# Altium schematic sheet LM2596.SchDoc
size A4
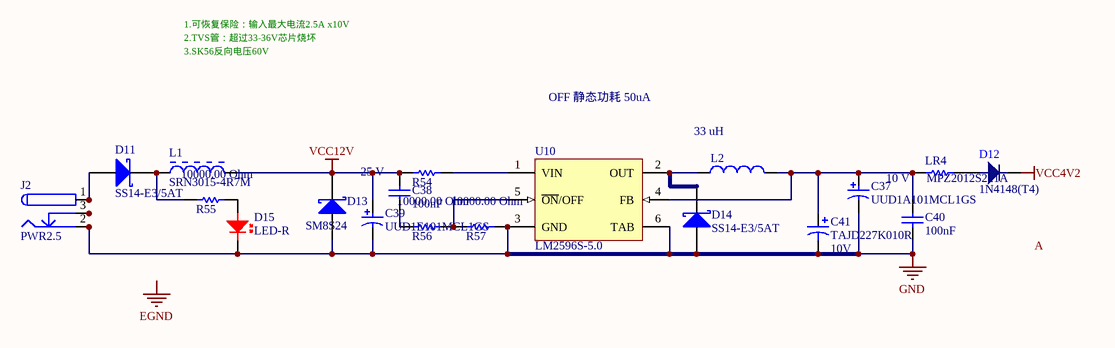
[diagram p0: LM2596.SchDoc]

## Parts
C37  UUD1A101MCL1GS  Rated Voltage: 10 V  [NIC-CAPA2-6.3X5.8_V]
C38  value 100nF  [CAPC0805(2012)100_L]  (hidden comment: CAP 100nF 50V 0805(2012))
C39  UUD1E101MCL1GS  Rated Voltage: 25 V  [NIC-CAPA2-6.3X7.7_V]
C40  value 100nF  [CAPC0805(2012)100_L]  (hidden comment: CAP 100nF 50V 0805(2012))
C41  TAJD227K010R  Rated Voltage: 10V  [AVX-CAPC7343_V]
D11  SS14-E3/5AT  [VISH-DO-214AC-2_V]
D12  1N4148(T4)  [SOD-123]
D13  SM8S24  [DIODE_SMC]
D14  SS14-E3/5AT  [VISH-DO-214AC-2_V]
D15  LED-R  [DIO-LIG]
J2  PWR2.5  [KLD-0202]
L1  SRN3015-4R7M  [BOUR-SRN3015-2_V]
L2  Inductance: 33 uH  [INDP5050X28N]  (hidden comment: SLF7045T-330M1R1-H)
LR4  MPZ2012S221A  [2012[0805]]
R54  2R 1% 0805(2012)  [RESC0805(2012)_L]  (value not drawn)
R55  value 10000.00 Ohm  [RESC0805(2012)_M]  (hidden comment: 10K 1% 0805(2012))
R56  value 10000.00 Ohm  [RESC0805(2012)_M]  (hidden comment: 10K 1% 0805(2012))
R57  value 10000.00 Ohm  [RESC0805(2012)_M]  (hidden comment: 10K 1% 0805(2012))
U10  LM2596S-5.0  [TS5B_N]

## Nets
GND: C37.2 C39.2 C40.1 C41.2 D13.1(A) D14.1(A) D15.2 J2.2 J2.2A J2.2B R57.2 U10.3(GND) U10.6(TAB)
VCC4V2: D12.2
VCC12V: C38.2 C39.1 D13.2(K) L1.2 R54.1
NetC37_1: C37.1 C40.2 C41.1 L2.2 LR4.1 U10.4(FB)
NetC38_1: C38.1 R56.1
NetD11_1: D11.1(A) J2.1 J2.1A J2.1B
NetD11_2: D11.2(K) L1.1 R55.1
NetD12_1: D12.1 LR4.2
NetD14_2: D14.2(K) L2.1 U10.2(OUT)
NetD15_1: D15.1 R55.2
NetJ2_3: J2.3 J2.3A J2.3B
NetR54_2: R54.2 U10.1(VIN)
NetR56_2: R56.2 R57.1 U10.5(~{ON}/OFF)

## Notes on the sheet
- 1.可恢复保险：输入最大电流2.5A x10V
- 2.TVS管：超过33-36V芯片烧坏
- 3.SK56反向电压60V
- OFF 静态功耗 50uA
- Labels drawn without touching a wire or pin: A, EGND

## Library data of the parts
C37 = CMP-0687-00054-1: Aluminum Electrolytic Capacitor, UD Series, Low Impedance, 100 uF, 10 V, + / - 20%, -55 to 105 degC, Chip Type, 6.3 x 5.8 mm D x L, Pb-Free, Reel; Manufacturer: Nichicon; Endurance Time: 2000 h; Packing: Dia382mm Reel; Tolerance Rated Capacitance: -20 to 20%; Rated Capacitance: 100 uF; Impedance: 0.44 Ohm; Rated Ripple Current (at 100kHz): 230 mA; ComponentLink1Description: Manufacturer URL; RoHS: TRUE; ComponentLink2Description: Datasheet; PackageReference: CAPAE-D6.3H5.8; Length: 5.8 mm; DatasheetVersion: 08/2012; ComponentLink3URL: http://products.nichicon.co.jp/en/pdf/XJA043/e-ud.pdf; ComponentLink1URL: http://www.nichicon.co.jp/; ComponentLink2URL: http://products.nichicon.co.jp/en/pdf/XJA043/e-ud.pdf; PartNumber: UUD1A101MCL1GS; PackageDescription: 2-Pin Surface Mount Device, Diameter 6.3 mm, Height 5.8 mm, Pitch 5.4 mm; ComponentLink3Description: Package Specification; Mounting Technology: Surface Mount; Diameter: 6.3 mm
C38 C40 = CMP-1036-04418-1: CAP 100nF 50V ±5% 0805 (2012 Metric) Thickness 1mm SMD; Case-EIA: 0805; Case-Metric: 2012; Tolerance: ±5%; Max Thickness: 1 mm; Technology: SMT; Rated Voltage: 50 V
C39 = CMP-0687-00063-1: Aluminum Electrolytic Capacitor, UD Series, Low Impedance, 100 uF, 25 V, + / - 20%, -55 to 105 degC, Chip Type, 6.3 x 7.7 mm D x L, Pb-Free, Reel; Manufacturer: Nichicon; Rated Ripple Current (at 100kHz): 280 mA; Endurance Time: 2000 h; Packing: Dia382mm Reel; Tolerance Rated Capacitance: -20 to 20%; Impedance: 0.34 Ohm; Rated Capacitance: 100 uF; PackageReference: CAPAE-D6.3H7.7; RoHS: TRUE; PackageDescription: 2-Pin Surface Mount Device, Diameter 6.3 mm, Height 7.7 mm, Pitch 5.4 mm; Mounting Technology: Surface Mount; ComponentLink3Description: Package Specification; Diameter: 6.3 mm; DatasheetVersion: 08/2012; PartNumber: UUD1E101MCL1GS; ComponentLink3URL: http://products.nichicon.co.jp/en/pdf/XJA043/e-ud.pdf; Length: 7.7 mm; ComponentLink2Description: Datasheet; ComponentLink2URL: http://products.nichicon.co.jp/en/pdf/XJA043/e-ud.pdf; ComponentLink1Description: Manufacturer URL; ComponentLink1URL: http://www.nichicon.co.jp/
C41 = CMP-0279-00002-1: Capacitor, Tantalum, 220uF 10% 10V MCCT-D (7343-31); Manufacturer: AVX; Polarity: Polarized; ComponentLink2URL: http://www.avx.com/docs/Catalogs/taj.pdf; PackageReference: CAPC7343; ComponentLink2Description: Datasheet; ComponentLink1URL: http://www.avx.com/; Mounting Technology: Surface Mount; PartNumber: TAJD227K010R; Technology: Tantalum; Tolerance: 10%; Capacitance: 220uF; PackageDescription: 2-Pin SMT Capacitor, 7.3 x 4.3 mm Body; ComponentLink1Description: Manufacturer URL; DatasheetVersion: Jul-13
D11 D14 = CMP-0549-00004-1: Schottky Barrier Rectifier, 40 V Maximum DC Blocking Voltage, -65 to 125 degC, 2-Pin SMA Case, RoHS; Manufacturer: Vishay Semiconductor; IFSM: 40 A; IF(AV): 1 A Max.; VRRM: 40 V Max.; VRMS: 28 V Max.; PackageReference: DO-214AC-2; RoHS: TRUE; DatasheetVersion: 12/17/2012; ComponentLink1Description: Manufacturer URL; ComponentLink2URL: http://www.vishay.com/docs/88746/ss12.pdf; PartNumber: SS14-E3/5AT; PackageVersion: Dec-12; Operating Temperature: -65 to 125 degC; ComponentLink3URL: http://www.vishay.com/docs/88746/ss12.pdf; PackageDescription: 2-Pin SMD, Body 4.245 x 2.665 mm, Height 2.29 mm; ComponentLink1URL: http://www.vishay.com/; ComponentLink3Description: Package Specification; ComponentLink2Description: Datasheet; Mounting Technology: Surface Mount; VDC: 40 V Max.
D12 = 1N4148: 高速开关二极管
D13 = 30BQ040: TVS
D15 = LED-RED: 红色LED
J2 = PWR2.5: Low Voltage Power Supply Connector; Published: 17-Dec-2003; DatasheetDocument: 09-May-2002; Publisher: Altium Limited; ComponentLink1Description: Manufacturer Link; ComponentLink1URL: http://domino.kycon.com/internet/Products.html
L1 = CMP-0007-00005-1: Semi-shielded Power Inductor, 4.7 uH, +/- 20%, 1.4 A, -40 to 125 degC, 3 x 3 x 1.5 mm SMD, RoHS and Halogen Free, Tape and Reel; Manufacturer: Bourns; SRF Min: 65 MHz; Inductance: 4.7 uH; Isat: 1.2 A; Resistance to Solder Heat: +260 degC for 10 sec.; Rated current: 1.4 A; Inductance tolerance: +/- 20%; DCR Max: 0.136 Ohm; RoHS: TRUE; ComponentLink2Description: Datasheet; PackageDescription: 2-Pin SMD, Body 3 x 3 mm, Height 1.5 mm; ComponentLink2URL: http://www.bourns.com/data/global/pdfs/SRN3015.pdf; ComponentLink1URL: http://www.bourns.com/; Packing: Tape and Reel; Mounting Technology: Surface Mount; ComponentLink3URL: http://www.bourns.com/data/global/pdfs/SRN3015.pdf; PackageReference: SRN3015; Operating Temperature: -40 to 125 degC; DatasheetVersion: Aug-11; ComponentLink1Description: Manufacturer URL; ComponentLink3Description: Package Specification; PartNumber: SRN3015-4R7M
L2 = Inductor: 固定电感器 SMD Power Inductor; Manufacturer: TDK; Core Material: Ferrite; Maximum DC Current: 1.1 A; Maximum DC Resistance: 96 mOhms; Shielding: Shielded; Tolerance: 20 %; Type: Wound Ferrite Inductor for Power Circuits; Case Height: 4.5 mm; Case Length: 7 mm; Test Frequency: 100 kHz; Supplier 1: Mouser; Supplier Part Number 1: 810-SLF7045T330M1R1H; Manufacturer Part Number: SLF7045T-330M1R1-H; RoHS: RoHS Compliant; Category: Fixed Inductors; Stock 1: 17; Pricing 1: 1=1.84, 10=1.38, 100=1.06, 500=0.780, 1000=0.734, 2000=0.689, 10000=0.666, 25000=0.643 (AUD); Operating Temperature Range: - 40 C to + 105 C; Package / Case: 7045 metric; Packaging: Reel; Product: Power Inductors; Series: SLF; Termination Style: SMD/SMT; Brand: TDK; Case Width: 7 mm; Product Category: Magnetic Shielded SMD Inductors; Standard Pack Qty: 1000; RoHS - Mouser: Y; Minimum Order Quantity: 1; Reeling: True; ComponentLink1URL: http://www.mouser.com/catalog/specsheets/tdk_e531_slf.pdf; ComponentLink1Description: http://www.mouser.com/catalog/specsheets/tdk_e531_slf.pdf
LR4 = Res Semi: 电磁干扰滤波珠子、扼流圈和阵列 Ferrite Chip Beads; Manufacturer: TDK; 阻抗: 220 Ohms; 最大直流电流: 3 A; 最大直流电阻: 0.04 Ohms; 工作温度范围: - 55 C to + 125 C; 封装 / 箱体: 2012; 封装: Reel; 端接类型: SMD/SMT; 容差: 25 %; 产品种类: Ferrite Beads; 标准包装数量: 4000; Supplier 1: Mouser; Supplier Part Number 1: 810-MPZ2012S221A; Manufacturer Part Number: MPZ2012S221A; RoHS: RoHS Compliant; Description 1: 电磁干扰滤波珠子、扼流圈和阵列 Ferrite Chip Beads; Category: 电磁干扰滤波珠子、扼流圈和阵列; Stock 1: 26540; Pricing 1: 1=0.070, 50=0.060, 100=0.053, 500=0.040, 1000=0.035, 4000=0.031, 8000=0.029, 12000=0.025 (USD); 制造商: TDK; RoHS - 贸泽: Y; Minimum Order Quantity: 1; Reeling: True; ComponentLink1URL: http://www.mouser.com/ds/2/400/e9413_mpz-24582.pdf; ComponentLink1Description: http://www.mouser.com/ds/2/400/e9413_mpz-24582.pdf
R54 = CMP-1013-00203-1: 2R 0.125W 1% 0805 (2012 Metric)  SMD; Case-EIA: 0805; Value: 2.00 Ohm; Case-Metric: 2012; Tolerance: 1 %; Power: 0.125 W; Technology: SMT
R55-R57 = CMP-1013-00623-1: 10K 0.125W 1% 0805 (2012 Metric)  SMD; Case-Metric: 2012; Case-EIA: 0805; Tolerance: 1 %; Power: 0.125 W; Technology: SMT
U10 = LM2596S-5.0: SIMPLE SWITCHER?Power Converter 150 KHz 3A Step-Down Voltage Regulator, 5-pin TO-263; Manufacturer: National Semiconductor; PackageTopMarking: NSUZXYTTE#*LM2596S*-5.0 P+; PowerWise: N; High-Reliability: Y; DatasheetVersion: May-2002; PackageVersion: revD, Apr-2005; PackageReference: TS5B; PackageDescription: TO-263, Molded, .400 x .390 x .180in, 5 Lead, .067in Pitch, Surface Mount; PartNumber: LM2596S-5.0; RoHS: N; PinCount: 5; CompType: Switcher; Code_JEDEC: MO-169-AB; ComponentLink1Description: Manufacturer URL; ComponentLink1URL: http://www.national.com/; ComponentLink2Description: LM2596 Datasheet; ComponentLink2URL: http://www.national.com/ds/LM/LM2596.pdf; ComponentLink3Description: LM2596 Web Page; ComponentLink3URL: http://www.national.com/pf/LM/LM2596.html; ComponentLink4Description: TS5B Package Page; ComponentLink4URL: http://www.national.com/packaging/folders/ts5b.html